# EAGLE schematic Mainboard v4 (EAGLE 7.2.0)

## Sheet 1 of 2
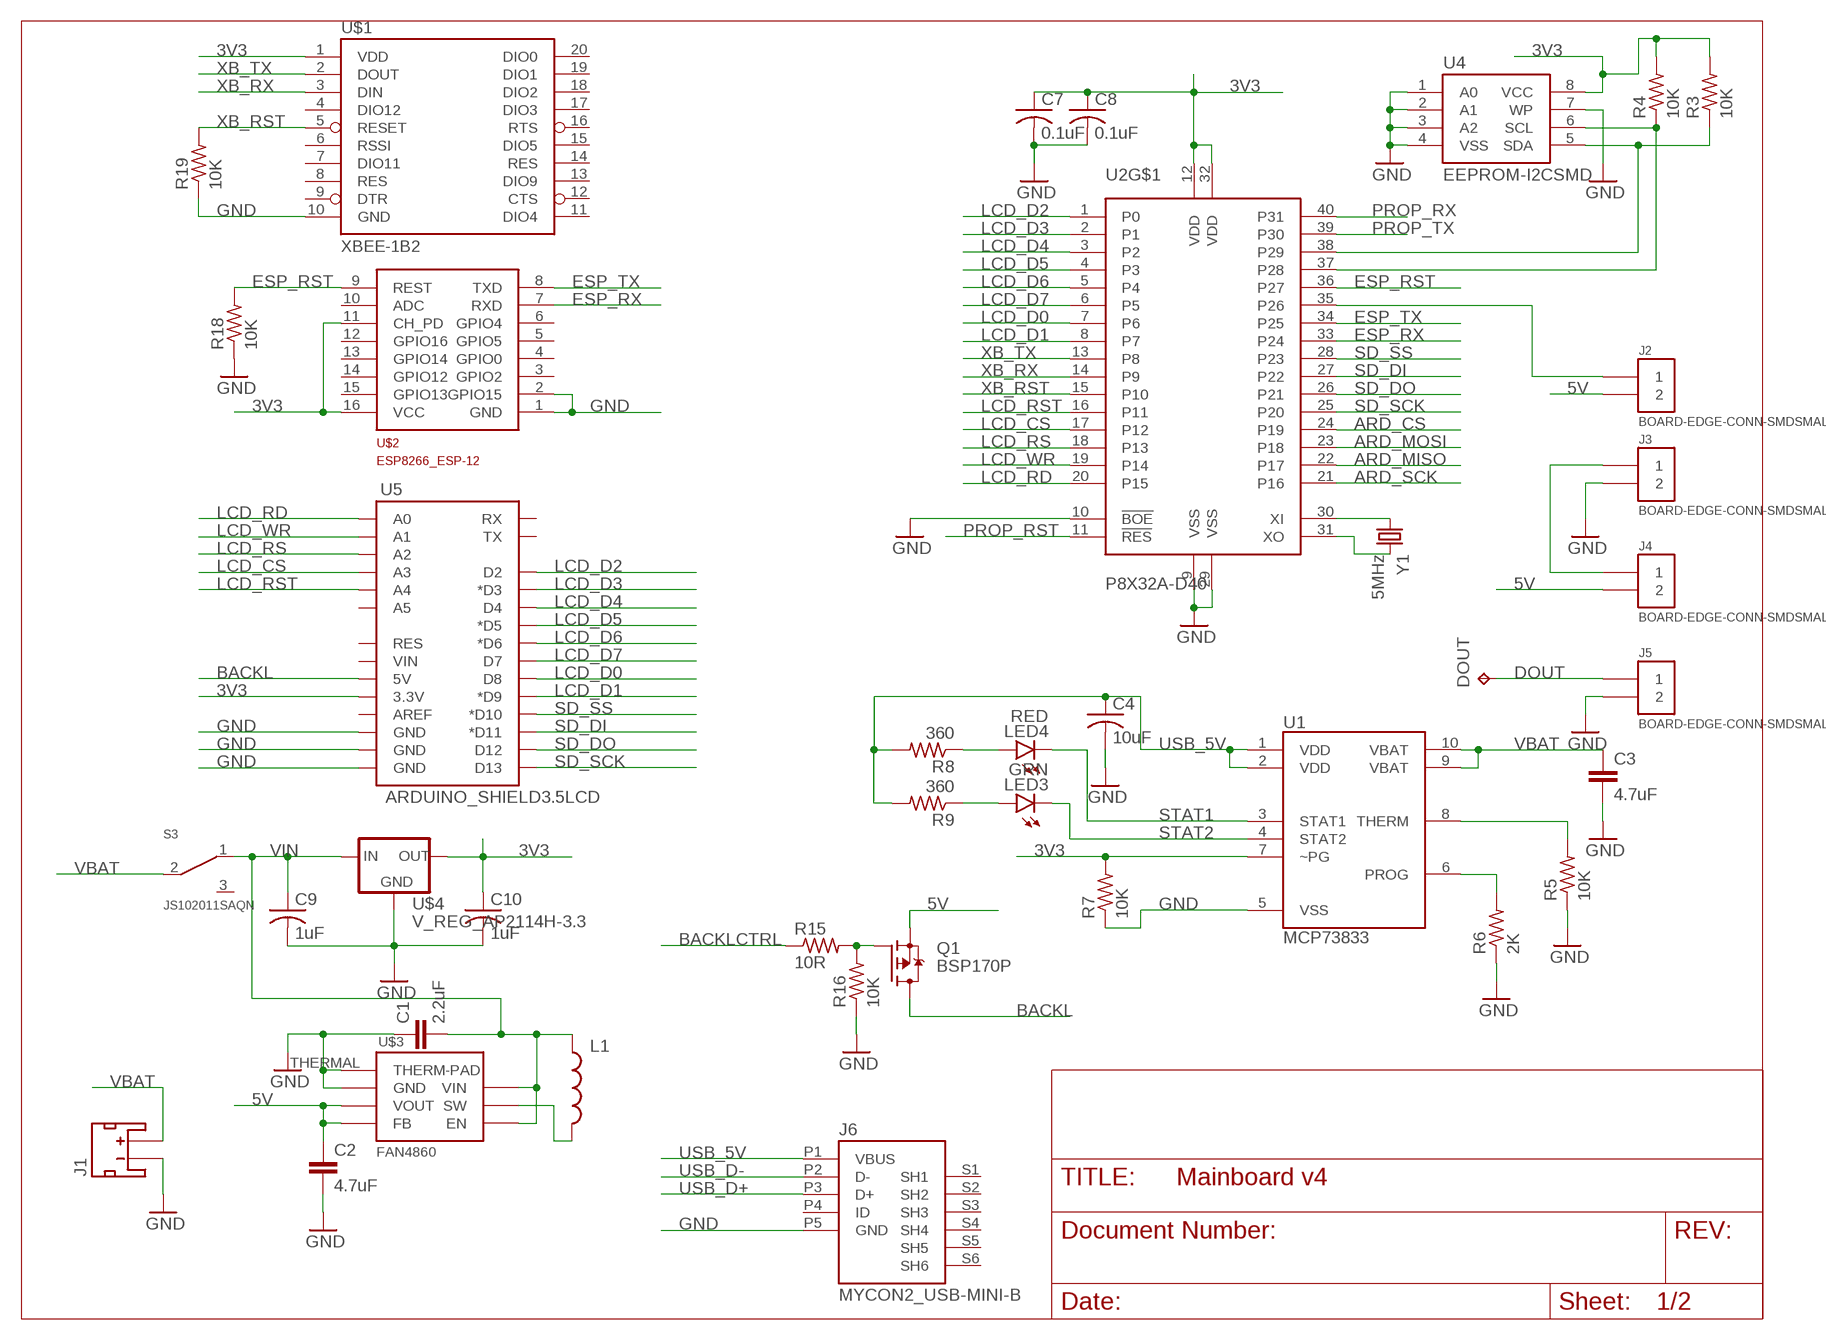
[diagram p0: schematic, sheet 1]

### Parts
C1  2.2uF  CAP0402-CAP  [0402-CAP]
C2  4.7uF  CAP0603-CAP  [0603-CAP]
C3  4.7uF  CAP0603-CAP  [0603-CAP]
C4  10uF  C-USC1206K  [C1206K]
C7  0.1uF  C-USC0805  [C0805]
C8  0.1uF  C-USC0805  [C0805]
C9  1uF  C-USC1206K  [C1206K]
C10  1uF  C-USC1206K  [C1206K]
DOUT  TPPAD1-13  [P1-13]
J1  JST_2MM_MALE  [JST-2-SMD]
J2  BOARD-EDGE-CONN-SMDSMALL  [SMD-2-SMALL]
J3  BOARD-EDGE-CONN-SMDSMALL  [SMD-2-SMALL]
J4  BOARD-EDGE-CONN-SMDSMALL  [SMD-2-SMALL]
J5  BOARD-EDGE-CONN-SMDSMALL  [SMD-2-SMALL]
J6  MYCON2_USB-MINI-B  [CON2_USB_MICRO_B_AT]
L1  INDUCTOR0805  [0805]
LED3  GRN  LED0603  [LED-0603]
LED4  RED  LED0603  [LED-0603]
Q1  BSP170P  [SOT223]
R3  10K  R-US_R0603  [R0603]
R4  10K  R-US_R0603  [R0603]
R5  10K  R-US_R0603  [R0603]
R6  2K  R-US_R0603  [R0603]
R7  10K  R-US_R0603  [R0603]
R8  360  R-US_R0603  [R0603]
R9  360  R-US_R0603  [R0603]
R15  10R  R-US_R0603  [R0603]
R16  10K  R-US_R0603  [R0603]
R18  10K  R-US_R0603  [R0603]
R19  10K  R-US_R0603  [R0603]
S3  JS102011SAQN  [SAQN]
U1  MCP73833  [MSOP-10]
U2  P8X32A-D40  [DIP-40]
U4  EEPROM-I2CSMD  [SO08]
U5  ARDUINO_SHIELD3.5LCD  [3.6TFT-LCD-SHIELD]
U$1  XBEE-1B2  [XBEE-SILK]
U$2  ESP8266_ESP-12  [ESP8266-ESP12E]
U$3  FAN4860  [6-UMLP]
U$4  V_REG_AP2114H-3.3  V_REG_MIC2920AP2114  [SOT223]
Y1  5MHz  CRYSTAL-TH-11.5X5MM  [CRYSTAL-SMD]

### Nets
3V3: C7.1 C8.1 C10.1 R3.2 R4.2 R7.2 U1.7(~PG) U2.12(VDD) U2.32(VDD) U4.8(VCC) U5.3.3V U$1.1(VDD) U$2.11(CH_PD) U$2.16(VCC) U$4.2(OUT) ; also sheet 2
5V: C2.1 J2.P$2 J4.P$2 Q1.3(S) U$3.P$2(VOUT) U$3.P$3(FB)
ARD_CS: U2.24(P19) ; also sheet 2
ARD_MISO: U2.22(P17) ; also sheet 2
ARD_MOSI: U2.23(P18) ; also sheet 2
ARD_SCK: U2.21(P16) ; also sheet 2
BACKL: Q1.2(D) Q1.4(D) U5.5V
BACKLCTRL: R15.1 ; also sheet 2
DOUT: DOUT.TP J5.P$1
ESP_RST: R18.2 U2.36(P27) U$2.9(REST)
ESP_RX: U2.33(P24) U$2.7(RXD)
ESP_TX: U2.34(P25) U$2.8(TXD)
GND: C1.1 C2.2 C3.2 C4.2 C7.2 C8.2 C9.2 C10.2 J1.1(-) J3.P$2 J5.P$2 J6.P5(GND) R5.1 R6.1 R7.1 R16.1 R18.1 R19.1 U1.5(VSS) U2.9(VSS) U2.10(!BOE) U2.29(VSS) U4.1(A0) U4.2(A1) U4.3(A2) U4.4(VSS) U4.7(WP) U5.GND@0(GND) U5.GND@1(GND) U5.GND@2(GND) U$1.10(GND) U$2.1(GND) U$2.2(GPIO15) U$3.P$1(GND) U$3.THERMAL(THERM-PAD) U$4.1(GND) ; also sheet 2
LCD_CS: U2.17(P12) U5.A3
LCD_D0: U2.7(P6) U5.D8
LCD_D1: U2.8(P7) U5.D9(*D9)
LCD_D2: U2.1(P0) U5.D2
LCD_D3: U2.2(P1) U5.D3(*D3)
LCD_D4: U2.3(P2) U5.D4
LCD_D5: U2.4(P3) U5.D5(*D5)
LCD_D6: U2.5(P4) U5.D6(*D6)
LCD_D7: U2.6(P5) U5.D7
LCD_RD: U2.20(P15) U5.A0
LCD_RS: U2.18(P13) U5.A2
LCD_RST: U2.16(P11) U5.A4
LCD_WR: U2.19(P14) U5.A1
N$3: J3.P$1 J4.P$1
N$4: J2.P$1 U2.35(P26)
N$6: R4.1 U2.37(P28) U4.6(SCL)
N$7: R3.1 U2.38(P29) U4.5(SDA)
N$21: U2.30(XI) Y1.P$1
N$22: U2.31(XO) Y1.P$2
N$43: LED4.A R8.1
N$44: LED3.A R9.1
N$53: R5.2 U1.8(THERM)
N$56: Q1.1(G) R15.2 R16.2
N$308: R6.2 U1.6(PROG)
N$309: L1.2 U$3.P$5(SW)
PROP_RST: U2.11(!RES)
PROP_RX: U2.40(P31) ; also sheet 2
PROP_TX: U2.39(P30) ; also sheet 2
SD_DI: U2.27(P22) U5.D11(*D11)
SD_DO: U2.26(P21) U5.D12
SD_SCK: U2.25(P20) U5.D13
SD_SS: U2.28(P23) U5.D10(*D10)
STAT1: LED4.C U1.3(STAT1) ; also sheet 2
STAT2: LED3.C U1.4(STAT2) ; also sheet 2
USB_5V: C4.1 J6.P1(VBUS) R8.2 R9.2 U1.1(VDD) U1.2(VDD) ; also sheet 2
USB_D+: J6.P3(D+) ; also sheet 2
USB_D-: J6.P2(D-) ; also sheet 2
VBAT: C3.1 J1.2(+) S3.2 U1.9(VBAT) U1.10(VBAT) ; also sheet 2
VIN: C1.2 C9.1 L1.1 S3.1 U$3.P$4(EN) U$3.P$6(VIN) U$4.3(IN)
XB_RST: R19.2 U2.15(P10) U$1.5(RESET)
XB_RX: U2.14(P9) U$1.3(DIN)
XB_TX: U2.13(P8) U$1.2(DOUT)
Unconnected: J1.NC1(PAD1) J1.NC2(PAD2) J6.P4(ID) J6.S1(SH1) J6.S2(SH2) J6.S3(SH3) J6.S4(SH4) J6.S5(SH5) J6.S6(SH6) S3.3 U5.A5 U5.AREF U5.RES U5.RX U5.TX U5.VIN U$1.4(DIO12) U$1.6(RSSI) U$1.7(DIO11) U$1.8(RES) U$1.9(DTR) U$1.11(DIO4) U$1.12(CTS) U$1.13(DIO9) U$1.14(RES) U$1.15(DIO5) U$1.16(RTS) U$1.17(DIO3) U$1.18(DIO2) U$1.19(DIO1) U$1.20(DIO0) U$2.3(GPIO2) U$2.4(GPIO0) U$2.5(GPIO5) U$2.6(GPIO4) U$2.10(ADC) U$2.12(GPIO16) U$2.13(GPIO14) U$2.14(GPIO12) U$2.15(GPIO13)

## Sheet 2 of 2
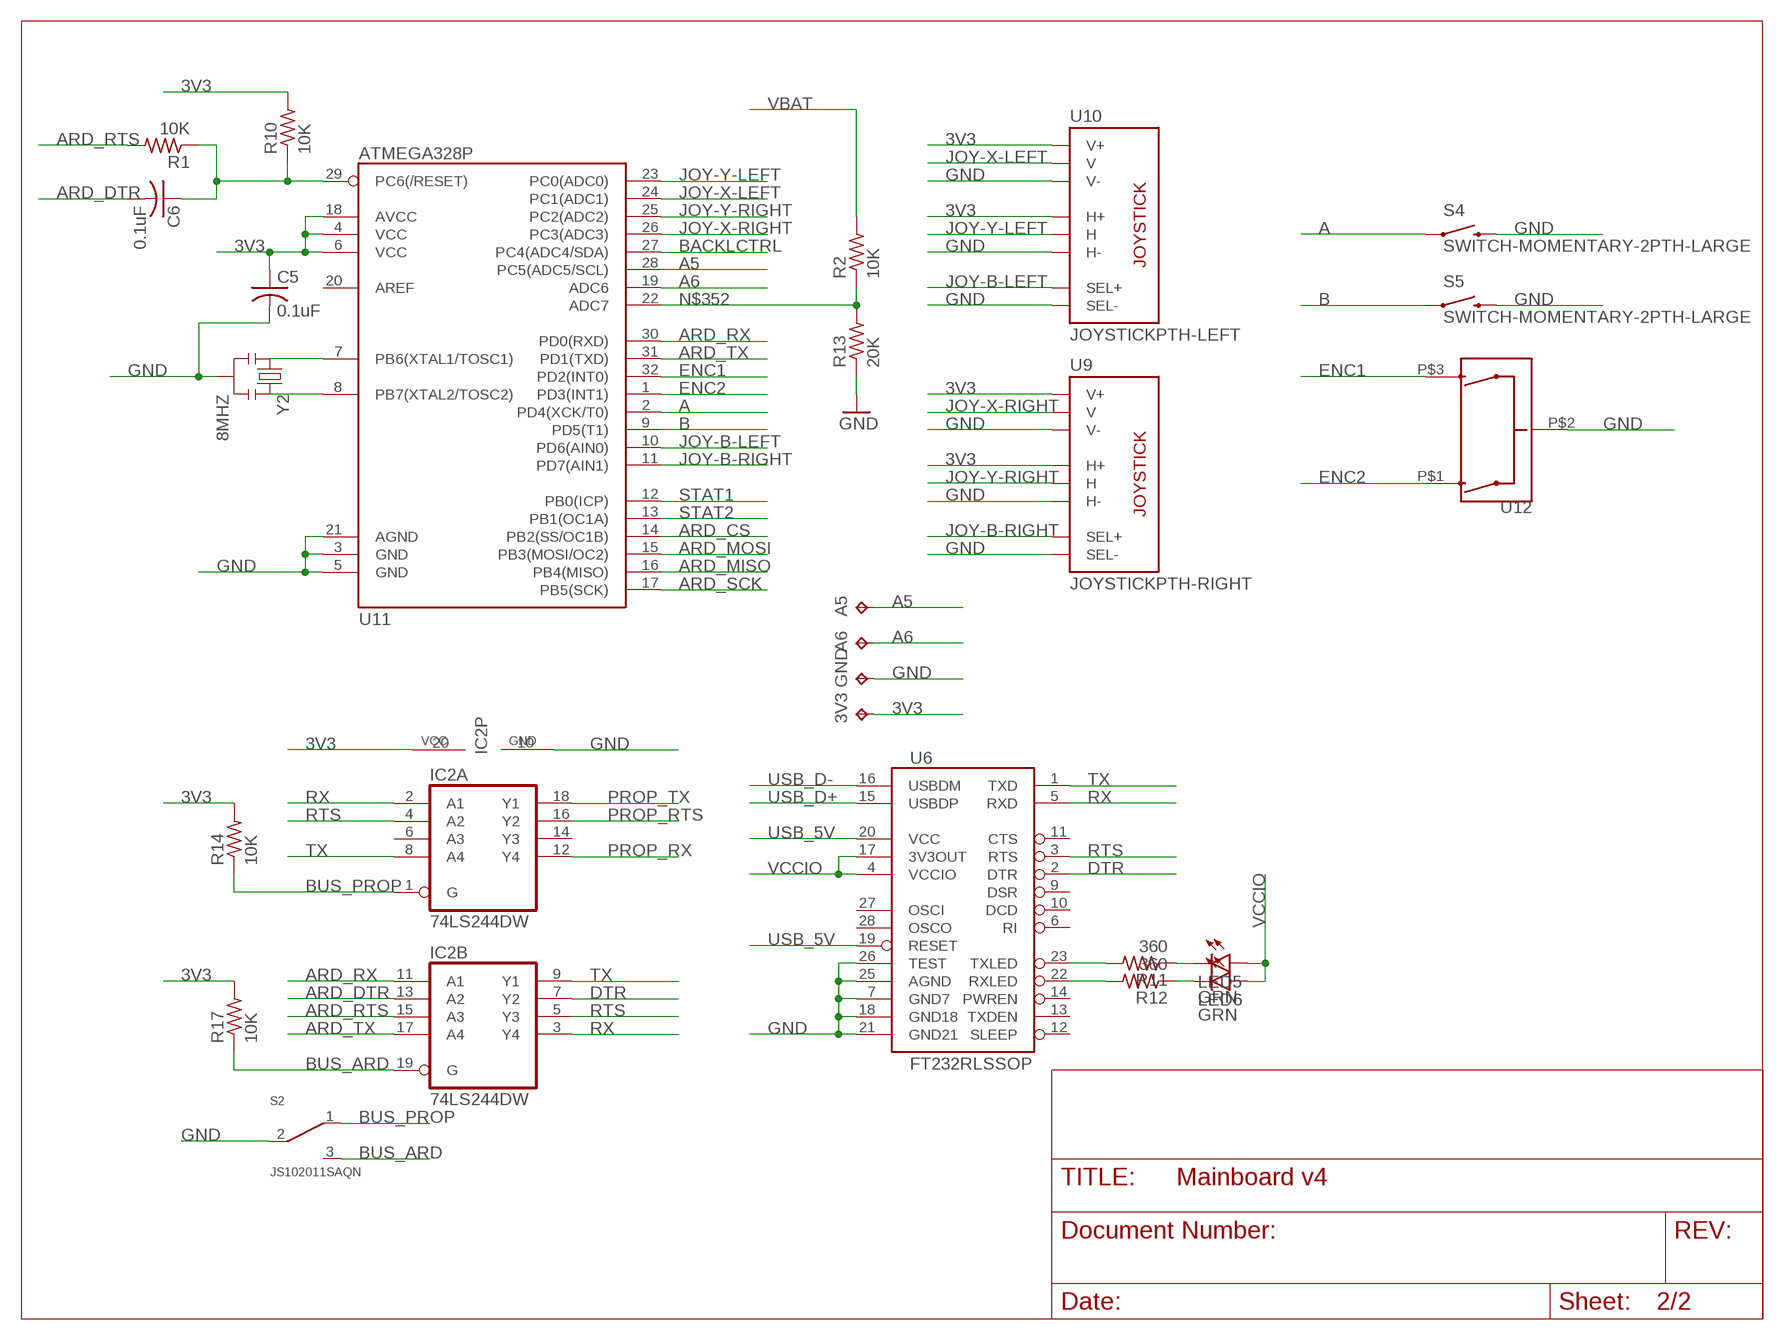
[diagram p1: schematic, sheet 2]

### Parts
3V3  TPPAD1-13  [P1-13]
A5  TPPAD1-13  [P1-13]
A6  TPPAD1-13  [P1-13]
C5  0.1uF  C-USC0805  [C0805]
C6  0.1uF  C-USC0805  [C0805]
GND  TPPAD1-13  [P1-13]
IC2  74LS244DW  [SO20W]
LED5  GRN  LED0603  [LED-0603]
LED6  GRN  LED0603  [LED-0603]
R1  10K  R-US_R0603  [R0603]
R2  10K  R-US_R0603  [R0603]
R10  10K  R-US_R0603  [R0603]
R11  360  R-US_R0603  [R0603]
R12  360  R-US_R0603  [R0603]
R13  20K  R-US_R0603  [R0603]
R14  10K  R-US_R0603  [R0603]
R17  10K  R-US_R0603  [R0603]
S2  JS102011SAQN  [SAQN]
S4  SWITCH-MOMENTARY-2PTH-LARGE  [TACTILE-PTH-LARGE]
S5  SWITCH-MOMENTARY-2PTH-LARGE  [TACTILE-PTH-LARGE]
U6  FT232RLSSOP  [SSOP28DB]
U9  JOYSTICKPTH-RIGHT  JOYSTICKPTH  [JOYSTICK]
U10  JOYSTICKPTH-LEFT  JOYSTICKPTH  [JOYSTICK]
U11  ATMEGA328P  ATMEGA328_SMT  [TQFP32-08]
U12  ENCODER-QUADRATURE  [ENCODER-12MM-VERT-SQ]
Y2  8MHZ  RESONATORAWSCR  [RESONATOR-AWSCR-CV]

### Nets
3V3: 3V3.TP C5.1 IC2.20(P:VCC) R10.2 R14.2 R17.2 U9.H1(H+) U9.V1(V+) U10.H1(H+) U10.V1(V+) U11.4(VCC) U11.6(VCC) U11.18(AVCC) ; also sheet 1
A: S4.P$1 U11.2(PD4(XCK/T0))
A5: A5.TP U11.28(PC5(ADC5/SCL))
A6: A6.TP U11.19(ADC6)
ARD_CS: U11.14(PB2(SS/OC1B)) ; also sheet 1
ARD_DTR: C6.2 IC2.13(B:A2)
ARD_MISO: U11.16(PB4(MISO)) ; also sheet 1
ARD_MOSI: U11.15(PB3(MOSI/OC2)) ; also sheet 1
ARD_RTS: IC2.15(B:A3) R1.2
ARD_RX: IC2.11(B:A1) U11.30(PD0(RXD))
ARD_SCK: U11.17(PB5(SCK)) ; also sheet 1
ARD_TX: IC2.17(B:A4) U11.31(PD1(TXD))
B: S5.P$1 U11.9(PD5(T1))
BACKLCTRL: U11.27(PC4(ADC4/SDA)) ; also sheet 1
BUS_ARD: IC2.19(B:G) R17.1 S2.3
BUS_PROP: IC2.1(A:G) R14.1 S2.1
DTR: IC2.7(B:Y2) U6.2(DTR)
ENC1: U11.32(PD2(INT0)) U12.P$3(B)
ENC2: U11.1(PD3(INT1)) U12.P$1(A)
GND: C5.2 GND.TP IC2.10(P:GND) R13.1 S2.2 S4.P$2 S5.P$2 U6.7(GND7) U6.18(GND18) U6.21(GND21) U6.25(AGND) U6.26(TEST) U9.B2A(SEL-) U9.H3(H-) U9.V3(V-) U10.B2A(SEL-) U10.H3(H-) U10.V3(V-) U11.3(GND) U11.5(GND) U11.21(AGND) U12.P$2(C) Y2.P$2 ; also sheet 1
JOY-B-LEFT: U10.B1A(SEL+) U11.10(PD6(AIN0))
JOY-B-RIGHT: U9.B1A(SEL+) U11.11(PD7(AIN1))
JOY-X-LEFT: U10.V2(V) U11.24(PC1(ADC1))
JOY-X-RIGHT: U9.V2(V) U11.26(PC3(ADC3))
JOY-Y-LEFT: U10.H2(H) U11.23(PC0(ADC0))
JOY-Y-RIGHT: U9.H2(H) U11.25(PC2(ADC2))
N$13: R11.2 U6.23(TXLED)
N$14: R12.2 U6.22(RXLED)
N$15: LED5.C R11.1
N$16: LED6.C R12.1
N$312: U11.7(PB6(XTAL1/TOSC1)) Y2.P$1
N$313: U11.8(PB7(XTAL2/TOSC2)) Y2.P$3
N$314: C6.1 R1.1 R10.1 U11.29(PC6(/RESET))
N$352: R2.1 R13.2 U11.22(ADC7)
PROP_RTS: IC2.16(A:Y2)
PROP_RX: IC2.12(A:Y4) ; also sheet 1
PROP_TX: IC2.18(A:Y1) ; also sheet 1
RTS: IC2.4(A:A2) IC2.5(B:Y3) U6.3(RTS)
RX: IC2.2(A:A1) IC2.3(B:Y4) U6.5(RXD)
STAT1: U11.12(PB0(ICP)) ; also sheet 1
STAT2: U11.13(PB1(OC1A)) ; also sheet 1
TX: IC2.8(A:A4) IC2.9(B:Y1) U6.1(TXD)
USB_5V: U6.19(RESET) U6.20(VCC) ; also sheet 1
USB_D+: U6.15(USBDP) ; also sheet 1
USB_D-: U6.16(USBDM) ; also sheet 1
VBAT: R2.2 ; also sheet 1
VCCIO: LED5.A LED6.A U6.4(VCCIO) U6.17(3V3OUT)
Unconnected: IC2.6(A:A3) IC2.14(A:Y3) U6.6(RI) U6.9(DSR) U6.10(DCD) U6.11(CTS) U6.12(SLEEP) U6.13(TXDEN) U6.14(PWREN) U6.27(OSCI) U6.28(OSCO) U11.20(AREF)

## Library data of the parts
3V3 A5 A6 DOUT GND = testpad:TP: Test pad
C1-C3 = SparkFun-Passives:CAP: Capacitor Standard 0603 ceramic capacitor, and 0.1" leaded capacitor.
C4-C10 = resistor:C-US: CAPACITOR, American symbol
IC2 = 74xx-us:74*244: Octal BUFFER and LINE DRIVER, 3-state
J1 = SparkFun-Connectors:JST_2MM_MALE: Mates to single-cell LiPo batteries. CONN-08352; PROD_ID: CONN-08352
J2-J5 = Board Edge Solder Connector SMD:BOARD-EDGE-CONN-SMD
J6 = SmartPrj:MYCON2_USB-MINI-B
L1 = SparkFun-Passives:INDUCTOR: Inductors Basic Inductor/Choke - 0603 and 1206. Footprints are not proven and vary greatly between part numbers. SRN6045- 33uH, 20% 1.4A SDR0403-560KL - 56uH, 10%, 500mA RMS/740mA peak
LED3-LED6 = SparkFun-LED:LED: LEDs Standard schematic elements and footprints for 5mm, 3mm, 1206, and 0603 sized LEDs. 5mm - Spark Fun Electronics SKU : COM-00529 (and others)
Q1 = transistor-fet:BSP170P: SIPMOS(R) Small-Signal-Transistor P-Channel, Enhancement mode Source: http://www.infineon.com/upload/Document/BSP170P_Rev2.4.pdf
R1-R19 = resistor:R-US_: RESISTOR, American symbol
S2 S3 = ck-comp-js-switches:JS102011SAQN: CK-Components JS Series Sub-Miniature Slide Switches SPDT SMD Right Angle
S4 S5 = SparkFun-Electromechanical:SWITCH-MOMENTARY-2: Various NO switches- pushbuttons, reed, etc
U1 = SparkFun-PowerIC:MCP73833: Stand-alone Linear Li-ion/Li-polymer Charge Management Controller Packages: DFN-10, MSOP-10 Last modified: 8/17/10 Unproven!
U2 = parallax_propeller:P8X32A-D40: Parallax Propeller P8X32A-D40 40 Pin DIP 32-bit Microprocessor http://www.parallax.com/propeller/
U4 = SparkFun-DigitalIC:EEPROM-I2C: I2C EEPROM chips, 24LC256 (and others)
U5 = SparkFun-Boards:ARDUINO_SHIELD: Arduino shield footprint
U6 = SparkFun-DigitalIC:FT232RL: USB UART FT232RL 4th Generation USB UART (USB <-> Serial) Controller. Spark Fun Electronics SKU : COM-00650 Production SKU IC-00870; PROD_ID: IC-00870
U9 U10 = SparkFun-Electromechanical:JOYSTICK: Thumb Joystick Joystick commonly found in PS2 controllers. Two pots and a select switch. Footprint proven. Spark Fun Electronics SKU : COM-09032
U11 = SparkFun-DigitalIC:ATMEGA328_SMT: 32-Pin Atmega328 part Commonly used on Arduino compatible boards Available in QFP and QFN packages TQFP is IC-09069 QFN is non-stock; PROD_ID: IC-09069
U12 = SparkFun-Electromechanical:ENCODER-QUADRATURE: quadrature encoder from Top-Up, part#EC16PHBF-B-20F-24-24C-16Y
U$1 = SparkFun-RF:XBEE-1: Xbee module footprints SMT header is CONN-09042.
U$2 = ESP8266-ESP12:ESP8266_ESP-12
U$3 = FAN4860:FAN4860
U$4 = SparkFun-PowerIC:V_REG_MIC2920: MIC2920A (http://www.micrel.com/_PDF/mic2920.pdf) - 400mA output LDO Regulator
Y1 = Crystal-TH-11_5x5:CRYSTAL-TH-11.5X5MM
Y2 = SparkFun-FreqCtrl:RESONATOR: Resonator Small SMD resonator. Used, eg, on the Arduino Pro/ Pro Mini boards. 8MHz- XTAL-08895 16MHz- XTAL-08900